# Altium schematic sheet RS485_R232.SchDoc
size 420 x 297 mm; SheetNumber: 18; SheetTotal: 20
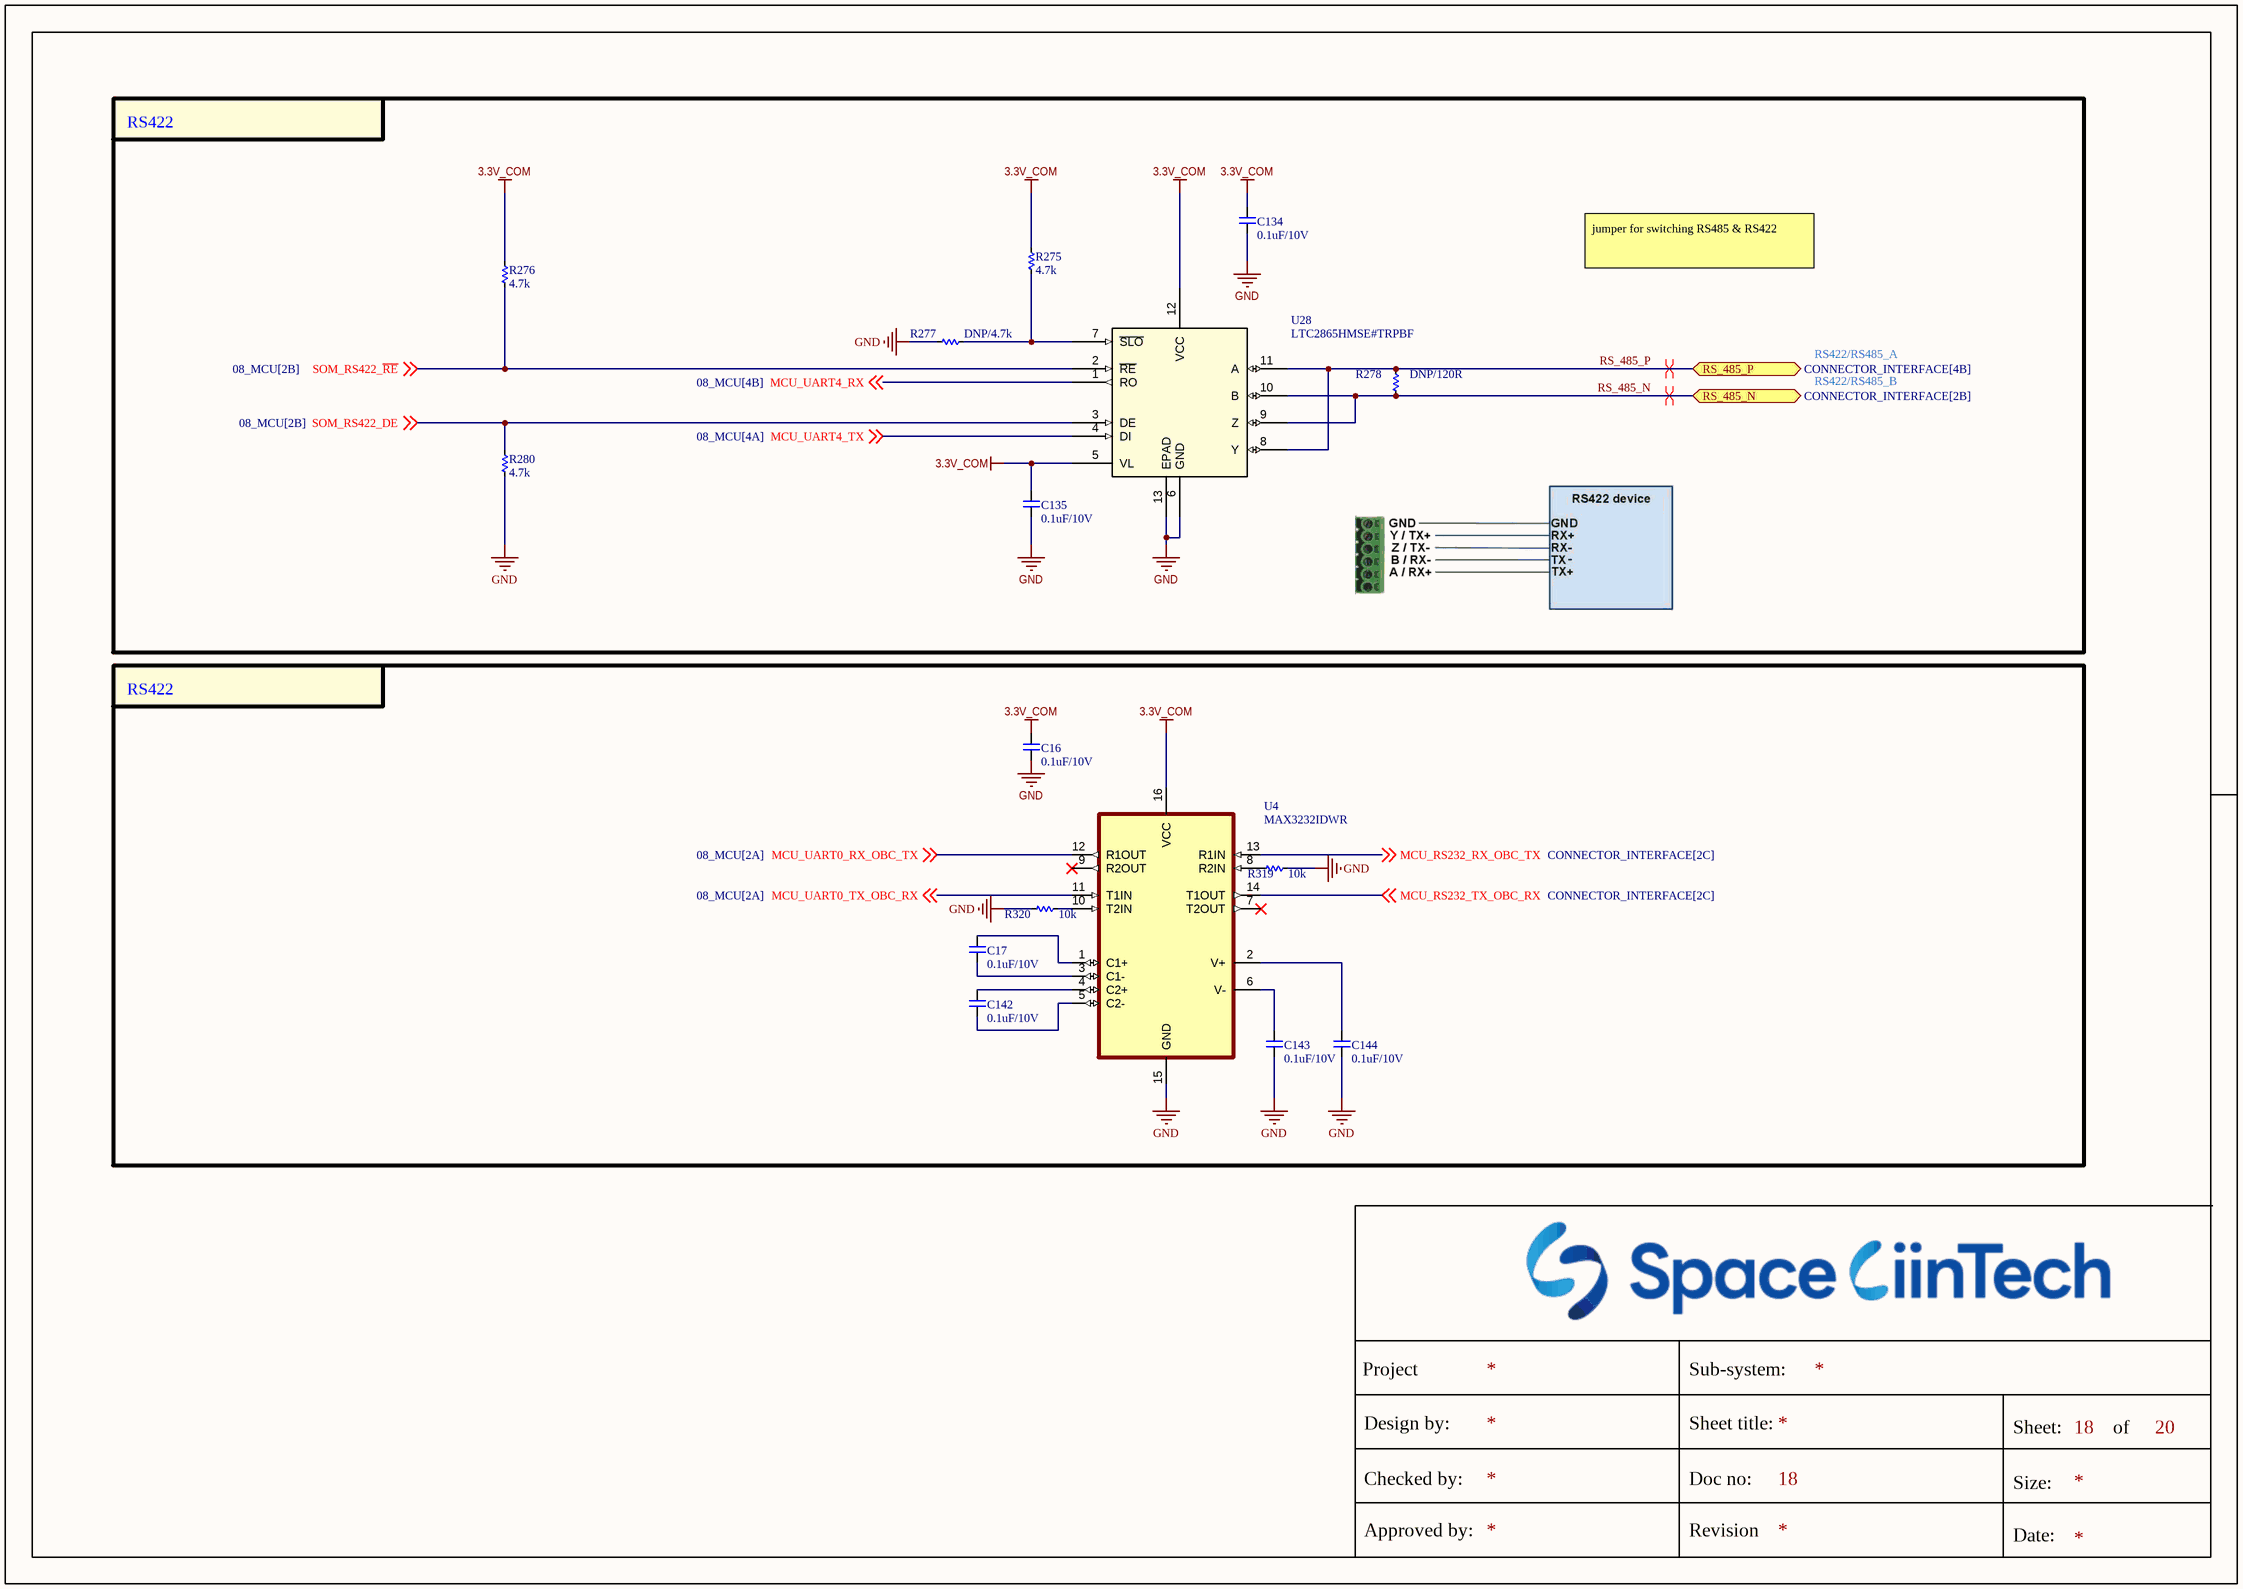
[diagram p0: RS485_R232.SchDoc]

## Parts
C16  0.1uF/10V  [CAP_C_1005X50_L]
C17  0.1uF/10V  [CAP_C_1005X50_L]
C134  0.1uF/10V  [CAP_C_1005X50_L]
C135  0.1uF/10V  [CAP_C_1005X50_L]
C142  0.1uF/10V  [CAP_C_1005X50_L]
C143  0.1uF/10V  [CAP_C_1005X50_L]
C144  0.1uF/10V  [CAP_C_1005X50_L]
R275  4.7k  [RES_C_1005x30_L]
R276  4.7k  [RES_C_1005x30_L]
R277  DNP/4.7k  [RES_C_1005x30_L]
R278  DNP/120R  [RES_C_1005x30_L]
R280  4.7k  [RES_C_1005x30_L]
R319  10k  [RES_C_1005X40]
R320  10k  [RES_C_1005X40]
U4  MAX3232IDWR  [SOIC127P1032X265-16N]
U28  LTC2865HMSE#TRPBF  [MSOP-12_MSE_LIT]

## Blocks framed on the sheet
RS422: C134 C135 R275-R278 R280 U28
RS422: C16 C17 C142-C144 R319 R320 U4

## Ports
RS_485_N (bidir, see CONNECTOR_INTERFACE[2B]), RS_485_P (bidir, see CONNECTOR_INTERFACE[4B])

## Nets
3.3V_COM: C16.2 C134.2 C135.2 R275.2 R276.2 U4.16(VCC) U28.5(VL) U28.12(VCC)
GND: C16.1 C134.1 C135.1 C143.1 C144.1 R277.2 R280.1 R319.1 R320.1 U4.15(GND) U28.6(GND) U28.13(EPAD)
MCU_RS232_RX_OBC_TX: U4.13(R1IN) ; off-sheet MCU_RS232_RX_OBC_TX
MCU_RS232_TX_OBC_RX: U4.14(T1OUT) ; off-sheet MCU_RS232_TX_OBC_RX
MCU_UART0_RX_OBC_TX: U4.12(R1OUT) ; off-sheet MCU_UART0_RX_OBC_TX
MCU_UART0_TX_OBC_RX: U4.11(T1IN) ; off-sheet MCU_UART0_TX_OBC_RX
MCU_UART4_RX: U28.1(RO) ; off-sheet MCU_UART4_RX
MCU_UART4_TX: U28.4(DI) ; off-sheet MCU_UART4_TX
RS_485_N: R278.2 U28.9(Z) U28.10(B) ; port RS_485_N
RS_485_P: R278.1 U28.8(Y) U28.11(A) ; port RS_485_P
SOM_RS422_DE: R280.2 U28.3(DE) ; off-sheet SOM_RS422_DE
SOM_RS422_~{RE}: R276.1 U28.2(~{RE}) ; off-sheet SOM_RS422_~{RE}
NetC17_1: C17.1 U4.3(C1-)
NetC17_2: C17.2 U4.1(C1+)
NetC142_1: C142.1 U4.5(C2-)
NetC142_2: C142.2 U4.4(C2+)
NetC143_2: C143.2 U4.6(V-)
NetC144_2: C144.2 U4.2(V+)
NetR275_1: R275.1 R277.1 U28.7(~{SLO})
NetR319_2: R319.2 U4.8(R2IN)
NetR320_2: R320.2 U4.10(T2IN)

Not connected (* = marked no-connect by the designer): U4 7(T2OUT)* 9(R2OUT)*

## Layout directives
differential pair: RS_485_N, RS_485_P

## Notes on the sheet
- jumper for switching RS485 & RS422
- RS422/RS485_A
- RS422/RS485_B
- Project
- Sub-system:
- Design by:
- Sheet title:
- Sheet:
- of
- Checked by:
- Approved by:
- Doc no:
- Revision
- Size:
- Date:

## Library data of the parts
C16 C17 C134 C135 C142-C144 = _CAP_C_2: CAP
R275-R278 R280 R319 R320 = _RES_B_2: RES
U4 = IC_RS232_MAX3232IDWR: 3.0V to 5.5V, Low-Power, Up to 1Mbps, True RS-232 Transceivers; MF: Analog Devices; MP: MAX3232CSE+T; SnapEDA_Link: https://www.snapeda.com/parts/MAX3232CSE+T/Analog+Devices/view-part/?ref=snap; Package: SOIC-16 Maxim Integrated; Value: *; Check_prices: https://www.snapeda.com/parts/MAX3232CSE+T/Analog+Devices/view-part/?ref=eda
U28 = LTC2865HMSETRPBF: Â±60V Fault Protected 3V to 5.5V RS485/RS422 Transceivers; Manufacturer_Name: Analog Devices Inc; Copyright: Copyright (C) 2025 Ultra Librarian. All rights reserved.; Manufacturer_Part_Number: LTC2865HMSE#TRPBF; RefDes: RefDes; Type: Type